# EAGLE design avc (EAGLE 9.0.1)
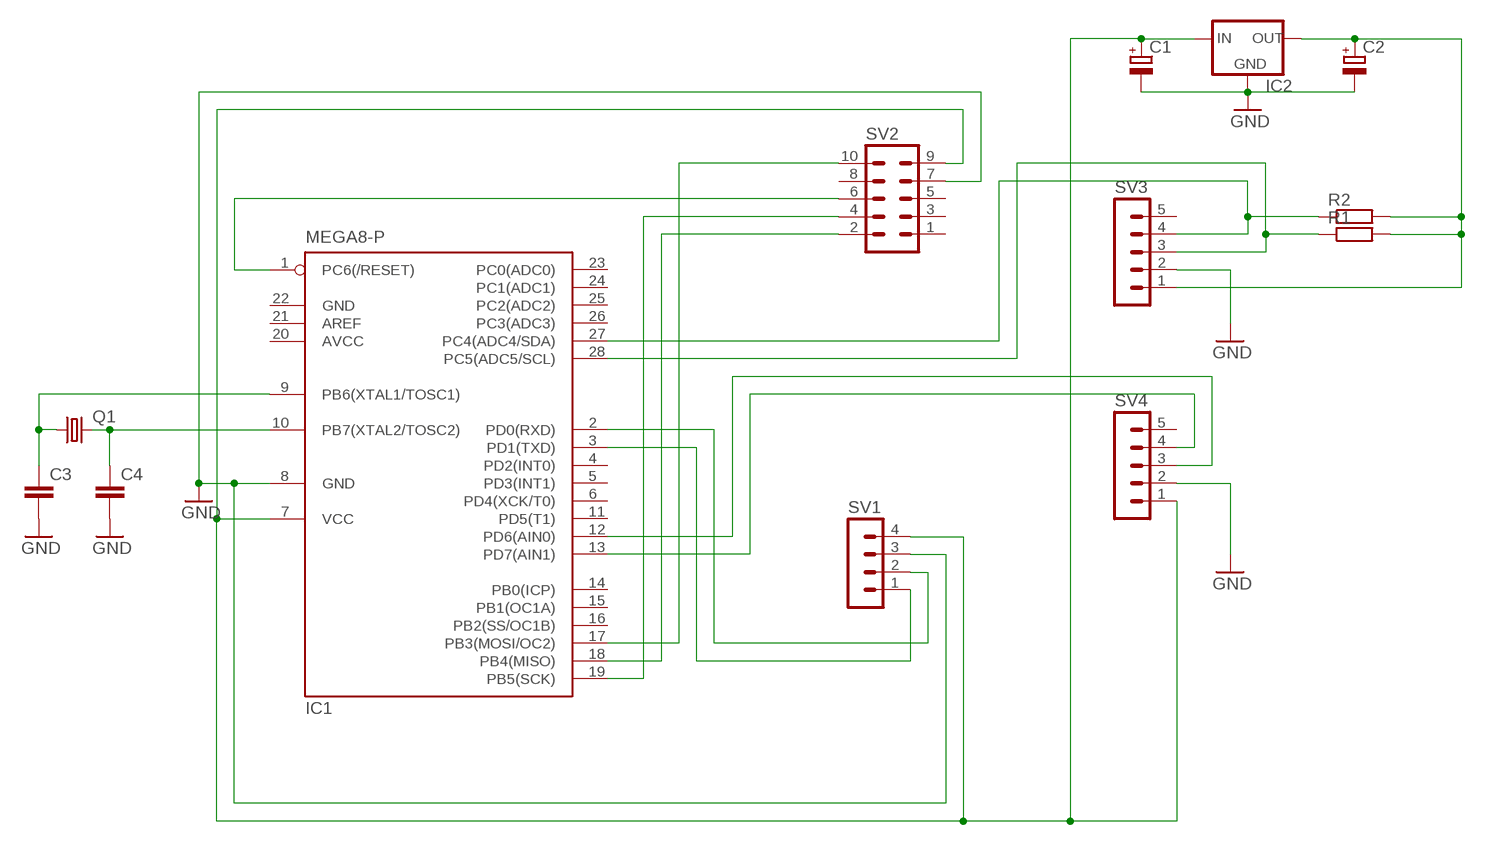
[diagram p0: schematic, sheet 1]

## Parts
C1  CPOL-EUE2.5-5  [E2,5-5]
C2  CPOL-EUE2.5-5  [E2,5-5]
C3  C-EU025-025X050  [C025-025X050]
C4  C-EU025-025X050  [C025-025X050]
IC1  MEGA8-P  [DIL28-3]
IC2  LH0070  [LH0070]
Q1  CRYSTALHC49S  [HC49/S]
R1  R-EU_0207/12  [0207/12]
R2  R-EU_0207/12  [0207/12]
SV1  MA04-1  [MA04-1]
SV2  MA05-2  [MA05-2]
SV3  MA05-1  [MA05-1]
SV4  MA05-1  [MA05-1]

## Nets
GND: C1.- C2.- C3.2 C4.2 IC1.8(GND) IC2.GND SV1.3 SV2.7 SV3.2 SV4.2
N$1: IC1.2(PD0(RXD)) SV1.2
N$2: IC1.3(PD1(TXD)) SV1.1
N$3: C3.1 IC1.9(PB6(XTAL1/TOSC1)) Q1.1
N$5: IC1.17(PB3(MOSI/OC2)) SV2.10
N$6: IC1.18(PB4(MISO)) SV2.2
N$7: IC1.1(PC6(/RESET)) SV2.6
N$8: IC1.19(PB5(SCK)) SV2.4
N$9: C4.1 IC1.10(PB7(XTAL2/TOSC2)) Q1.2
N$10: C1.+ IC1.7(VCC) IC2.IN SV1.4 SV2.9 SV4.1
N$11: C2.+ IC2.OUT R1.2 R2.2 SV3.1
N$13: IC1.13(PD7(AIN1)) SV4.4
N$14: IC1.12(PD6(AIN0)) SV4.3
N$16: IC1.27(PC4(ADC4/SDA)) R2.1 SV3.4
N$17: IC1.28(PC5(ADC5/SCL)) R1.1 SV3.3
Unconnected: IC1.4(PD2(INT0)) IC1.5(PD3(INT1)) IC1.6(PD4(XCK/T0)) IC1.11(PD5(T1)) IC1.14(PB0(ICP)) IC1.15(PB1(OC1A)) IC1.16(PB2(SS/OC1B)) IC1.21(AREF) IC1.23(PC0(ADC0)) IC1.24(PC1(ADC1)) IC1.25(PC2(ADC2)) IC1.26(PC3(ADC3)) SV2.1 SV2.3 SV2.5 SV2.8 SV3.5 SV4.5

## Power pins joined to a net without a drawn wire
AVCC: IC1.20(AVCC)
GND: IC1.22(GND)

## Library data of the parts
C1 C2 = resistor:CPOL-EU: POLARIZED CAPACITOR, European symbol
C3 C4 = resistor:C-EU: CAPACITOR, European symbol
IC1 = atmel:MEGA8-P: MICROCONTROLLER 8 Kbytes FLASH, 1 kbytes SRAM, 512 bytes EEPROM, USART, 4-channel 10 bit ADC, 2-channel 8 bit ADC Pin compatible with Atmega48, ATMega88, ATMega168 Source: avr.lbr; OC_FARNELL: unknown; OC_NEWARK: unknown
IC2 = v-reg:LH0070: VOLTAGE REGULATOR
Q1 = crystal:CRYSTAL: CRYSTAL; OC_FARNELL: 1667008; OC_NEWARK: unknown
R1 R2 = resistor:R-EU_: RESISTOR, European symbol
SV1 = con-lstb:MA04-1: PIN HEADER; OC_FARNELL: unknown; OC_NEWARK: unknown
SV2 = con-lstb:MA05-2: PIN HEADER; OC_FARNELL: unknown; OC_NEWARK: unknown
SV3 SV4 = con-lstb:MA05-1: PIN HEADER; OC_FARNELL: unknown; OC_NEWARK: unknown

## Board
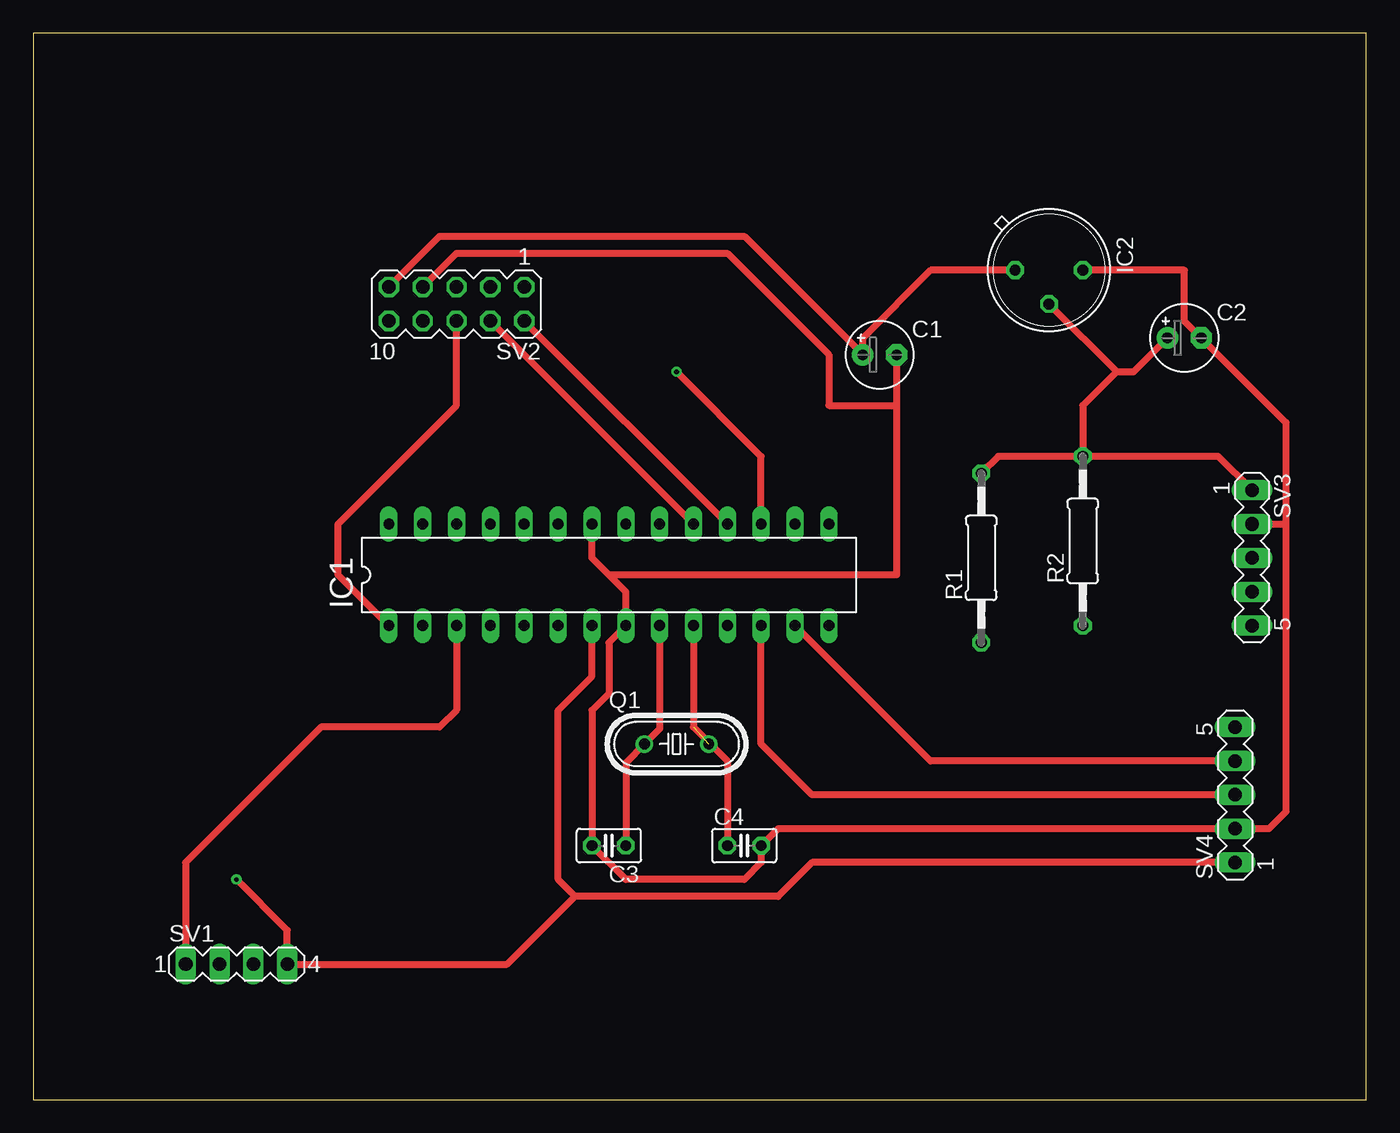
[diagram p1: board, top side]
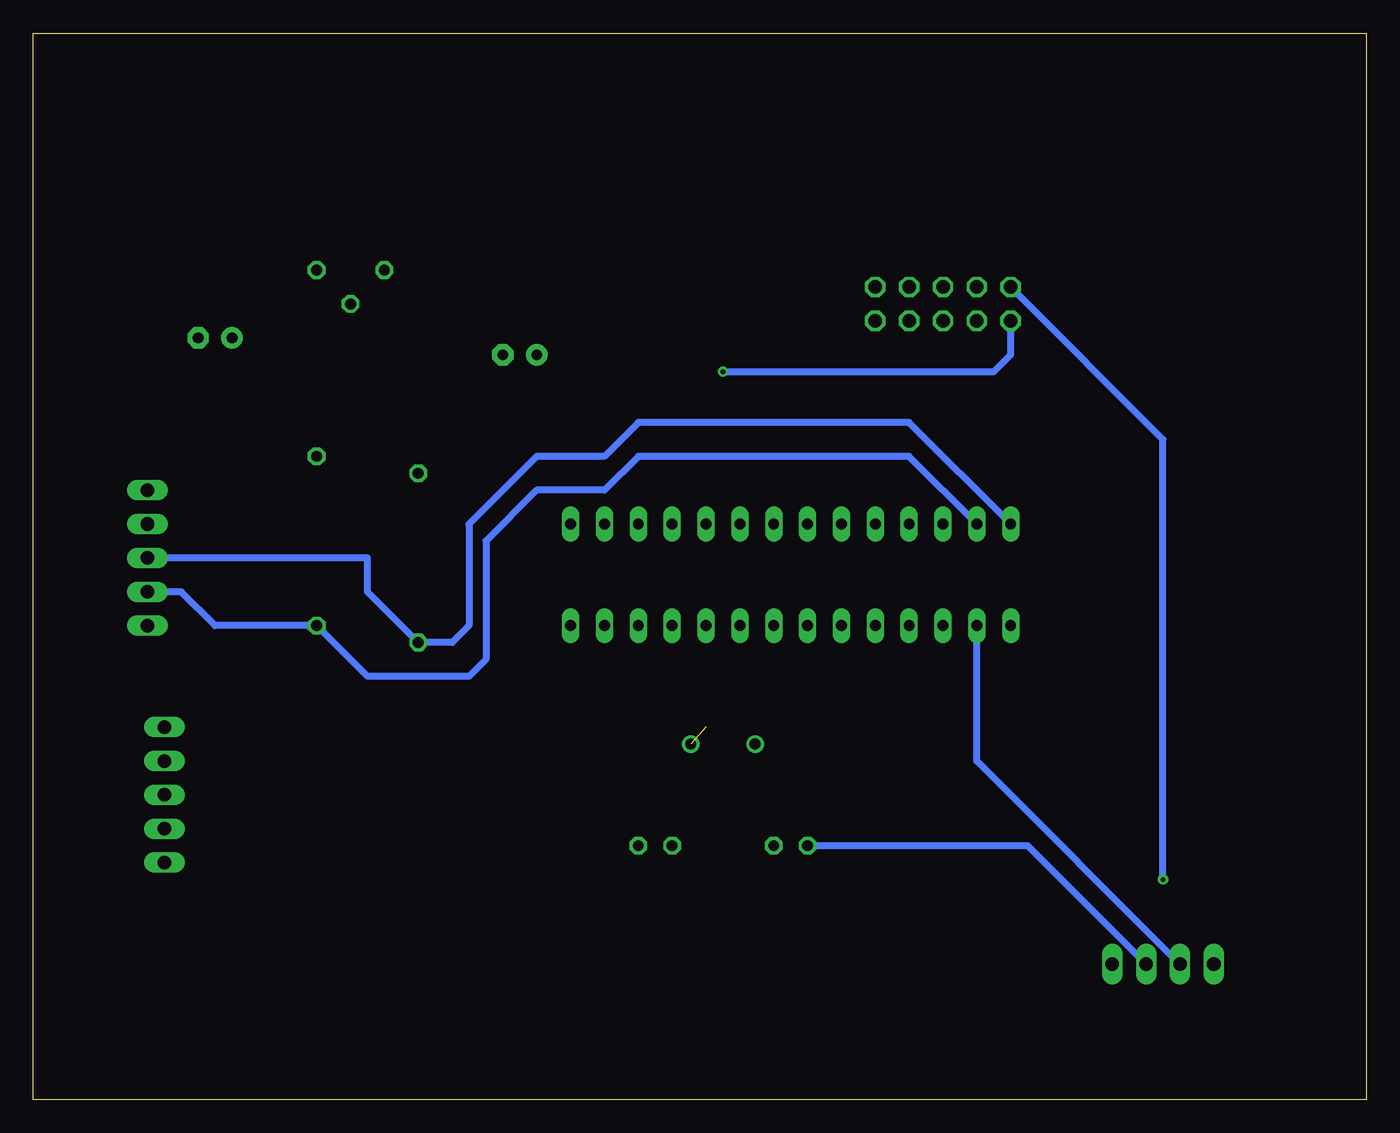
[diagram p2: board, bottom side, seen from below]

Size 100 x 80 mm. Coordinates in mm from the lower left corner, seen from the top.
Outline: 0,0 100,0 100,80 0,80 0,0
Copper layers (1*16): Top 0.035mm / dielectric 1.5mm / Bottom 0.035mm
Design rules "default": minimum track width 6mil, minimum drill 0.35mm, track to track 6mil, track to pad 6mil, pad to pad 6mil, via to via 6mil, smd to smd 6mil, copper to edge 40mil, drill to drill 6mil, minimum pad ring 10mil, minimum via ring 8mil, stop-mask expansion 4mil, vias tented up to drill 0mil, thermal gap 10mil

### Footprints (pad centres in the part's own frame; a part is rotated, then mirrored left to right if it is on the bottom)
E2,5-5 = drill 0.813 pad 1.6: + -1.27,0 | drill 0.813 pad 1.6 octagon: - 1.27,0
C025-025X050 = drill 0.813 octagon: 1 -1.27,0; 2 1.27,0
DIL28-3 = drill 0.813 long: 1 -16.51,-3.81; 2 -13.97,-3.81; 3 -11.43,-3.81; 4 -8.89,-3.81; 5 -6.35,-3.81; 6 -3.81,-3.81; 7 -1.27,-3.81; 8 1.27,-3.81; 9 3.81,-3.81; 10 6.35,-3.81; 11 8.89,-3.81; 12 11.43,-3.81; 13 13.97,-3.81; 14 16.51,-3.81; 15 16.51,3.81; 16 13.97,3.81; 17 11.43,3.81; 18 8.89,3.81; 19 6.35,3.81; 20 3.81,3.81; 21 1.27,3.81; 22 -1.27,3.81; 23 -3.81,3.81; 24 -6.35,3.81; 25 -8.89,3.81; 26 -11.43,3.81; 27 -13.97,3.81; 28 -16.51,3.81
LH0070 = drill 0.813 octagon: GND 0,2.54; IN 0,-2.54; OUT 2.54,0
HC49/S = drill 0.813: 1 -2.413,0; 2 2.413,0
0207/12 = drill 0.813 octagon: 1 -6.35,0; 2 6.35,0
MA04-1 = drill 1.016 long: 1 -3.81,0; 2 -1.27,0; 3 1.27,0; 4 3.81,0
MA05-2 = drill 1.016 octagon: 1 -5.08,-1.27; 2 -5.08,1.27; 3 -2.54,-1.27; 4 -2.54,1.27; 5 0,-1.27; 6 0,1.27; 7 2.54,-1.27; 8 2.54,1.27; 9 5.08,-1.27; 10 5.08,1.27
MA05-1 = drill 1.016 long: 1 -5.08,0; 2 -2.54,0; 3 0,0; 4 2.54,0; 5 5.08,0

### Placement (x,y rotation side)
C1  63.5,55.88 0 top
C2  86.36,57.15 0 top
C3  43.18,19.05 180 top
C4  53.34,19.05 0 top
IC1  43.18,39.37 0 top
IC2  76.2,62.23 270 top
Q1  48.26,26.67 0 top
R1  71.12,40.64 90 top
R2  78.74,41.91 90 top
SV1  15.24,10.16 0 top
SV2  31.75,59.69 180 top
SV3  91.44,40.64 270 top
SV4  90.17,22.86 90 top

### Tracks (layer width: path | path; a pad name or v marks a point on that pad's centre or on a via)
GND
  Top 0.508: 43.18,39.37 44.45,38.1 IC1.8 43.18,34.29 43.18,30.48 41.91,29.21 C3.2 44.45,16.51 53.34,16.51 54.61,17.78 C4.2 55.88,20.32 SV4.2 92.71,20.32 93.98,21.59 93.98,43.18 | 43.18,39.37 41.91,40.64 IC1.22 | C1.- 64.77,52.07 | 64.77,52.07 64.77,39.37 43.18,39.37 | SV2.7 31.75,63.5 52.07,63.5 59.69,55.88 59.69,52.07 64.77,52.07 | SV3.2 93.98,43.18 | 93.98,43.18 93.98,50.8 C2.- 86.36,58.42 86.36,62.23 IC2.GND
  Bottom 0.508: C3.2 25.4,19.05 SV1.3
N$1
  Bottom 0.508: SV1.2 29.21,25.4 IC1.2
N$2
  Top 0.508: IC1.3 31.75,29.21 30.48,27.94 21.59,27.94 11.43,17.78 SV1.1
N$3
  Top 0.508: IC1.9 46.99,27.81 Q1.1 44.45,25.27 C3.1
N$5  (via drill 0.35)
  Top 0.508: IC1.17 54.61,48.26 v48.26,54.61
  Bottom 0.508: v48.26,54.61 27.94,54.61 26.67,55.88 SV2.10
N$6
  Top 0.508: IC1.18 SV2.2
N$7
  Top 0.508: IC1.1 22.86,39.37 22.86,43.18 31.75,52.07 SV2.6
N$8
  Top 0.508: IC1.19 SV2.4
N$9  (1 unrouted)
  Top 0.508: IC1.10 49.53,27.94 52.07,25.4 C4.1
N$10  (via drill 0.35)
  Top 0.508: SV4.1 58.42,17.78 55.88,15.24 40.64,15.24 | 40.64,15.24 39.37,16.51 39.37,29.21 41.91,31.75 IC1.7 | 40.64,15.24 35.56,10.16 SV1.4 19.05,12.7 v15.24,16.51 | SV2.9 30.48,64.77 53.34,64.77 C1.+ 62.23,57.15 67.31,62.23 IC2.IN
  Bottom 0.508: v15.24,16.51 15.24,49.53 SV2.9
  other vias: 73.66,62.23
N$11
  Top 0.508: SV3.1 88.9,48.26 R2.2 | R2.2 72.39,48.26 R1.2 | C2.+ 82.55,54.61 81.28,54.61 | IC2.OUT 81.28,54.61 | 81.28,54.61 78.74,52.07 R2.2
N$13
  Top 0.508: SV4.4 67.31,25.4 IC1.13
N$14
  Top 0.508: SV4.3 58.42,22.86 54.61,26.67 IC1.12
N$16
  Bottom 0.508: IC1.27 34.29,48.26 54.61,48.26 57.15,45.72 62.23,45.72 66.04,41.91 66.04,33.02 67.31,31.75 74.93,31.75 R2.1 86.36,35.56 88.9,38.1 SV3.4
N$17
  Bottom 0.508: IC1.28 34.29,50.8 54.61,50.8 57.15,48.26 62.23,48.26 67.31,43.18 67.31,35.56 68.58,34.29 R1.1 74.93,38.1 74.93,40.64 SV3.3